# EAGLE design led_dimmer2 (EAGLE 6.5.0)
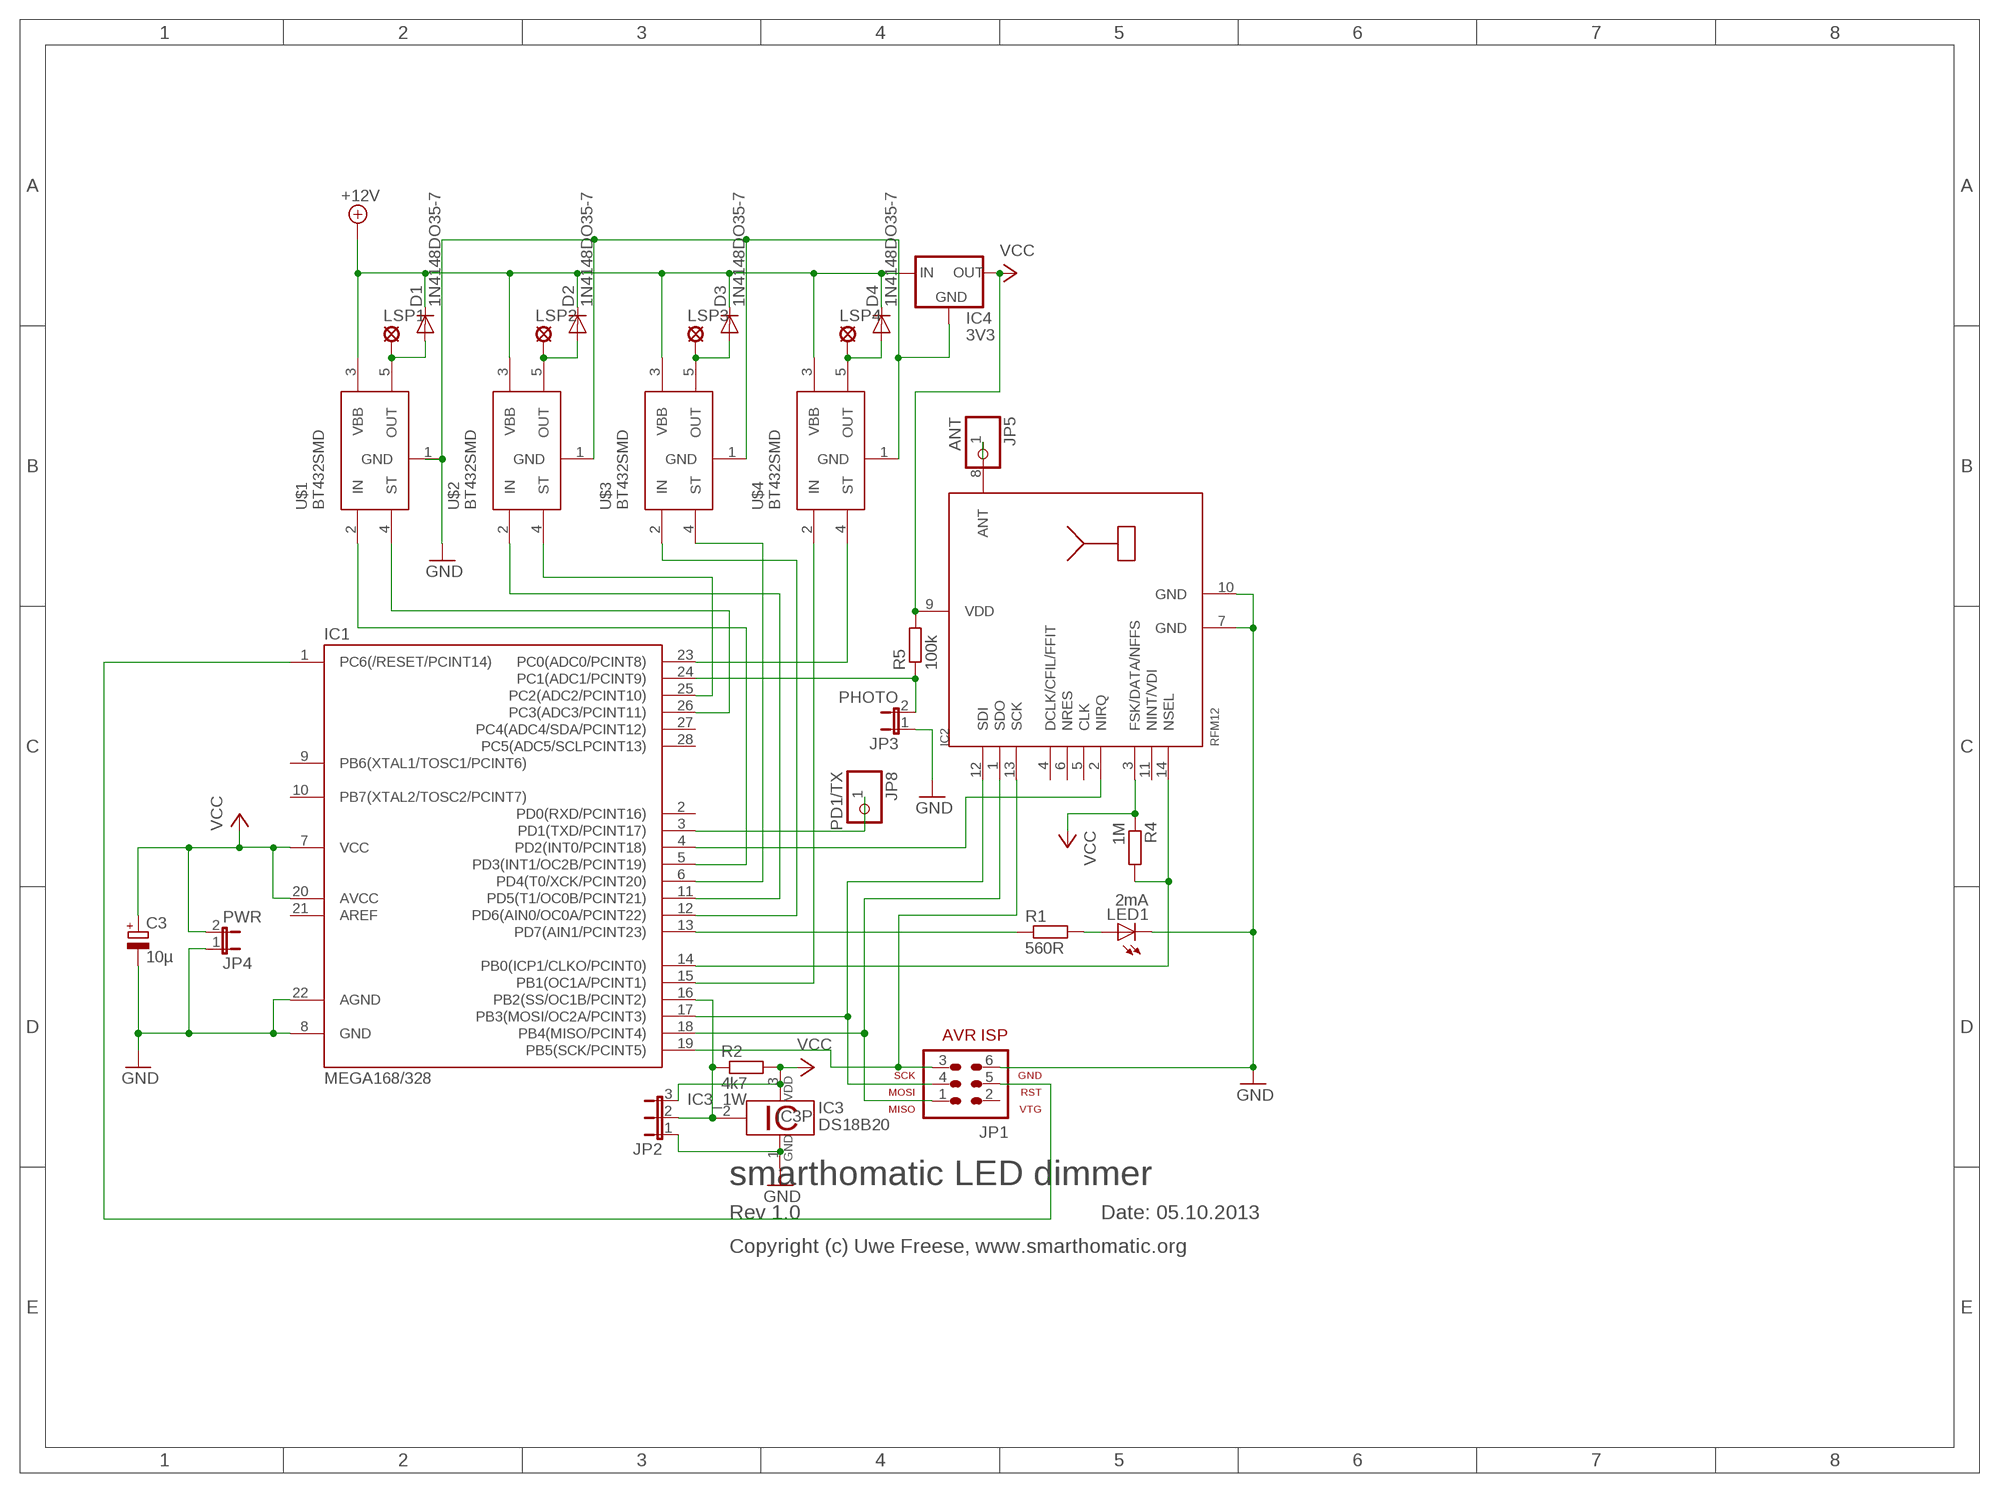
[diagram p0: schematic, sheet 1]

## Parts
C3  10µ  CPOL-EUE2.5-6  [E2,5-6]
D1  1N4148DO35-7  [DO35-7]
D2  1N4148DO35-7  [DO35-7]
D3  1N4148DO35-7  [DO35-7]
D4  1N4148DO35-7  [DO35-7]
IC1  MEGA168/328  MEGA48/88/168-PU  [DIL28-3]
IC2  RFM12  [RFM]
IC3  DS18B20  [TO92-]
IC4  3V3  78LXX  [78LXX]
JP1  AVR-ISP-6  [AVR-ISP-6]
JP2  JP2E  [JP2]
JP3  PHOTO  JP1E  [JP1]
JP4  PWR  JP1E  [JP1]
JP5  ANT  PINHD-1X1  [1X01]
JP8  PD1/TX  PINHD-1X1  [1X01]
LED1  2mA  LED3MM  [LED3MM]
LSP1  MCS10B  [MCS10B]
LSP2  MCS10B  [MCS10B]
LSP3  MCS10B  [MCS10B]
LSP4  MCS10B  [MCS10B]
R1  560R  R-EU_0207/7  [0207/7]
R2  4k7  R-EU_0207/7  [0207/7]
R4  1M  R-EU_0207/7  [0207/7]
R5  100k  R-EU_0207/7  [0207/7]
U$1  BT432SMD  [TO220-58]
U$2  BT432SMD  [TO220-58]
U$3  BT432SMD  [TO220-58]
U$4  BT432SMD  [TO220-58]

## Nets
+12V: D1.C D2.C D3.C D4.C IC4.IN U$1.3(VBB) U$2.3(VBB) U$3.3(VBB) U$4.3(VBB)
GND: C3.- IC1.8(GND) IC1.22(AGND) IC2.7(GND) IC2.10(GND) IC3.1 IC4.GND JP1.6 JP2.1 JP3.1 JP4.1 LED1.K(C) U$1.1(GND) U$2.1(GND) U$3.1(GND) U$4.1(GND)
N$1: IC1.24(PC1(ADC1/PCINT9)) JP3.2 R5.1
N$2: IC1.23(PC0(ADC0/PCINT8)) U$4.4(ST)
N$3: IC1.17(PB3(MOSI/OC2A/PCINT3)) IC2.12(SDI) JP1.4
N$4: IC1.18(PB4(MISO/PCINT4)) IC2.1(SDO) JP1.1
N$5: IC1.19(PB5(SCK/PCINT5)) IC2.13(SCK) JP1.3
N$6: IC1.13(PD7(AIN1/PCINT23)) R1.1
N$7: D1.A LSP1.MP U$1.5(OUT)
N$8: IC1.1(PC6(/RESET/PCINT14)) JP1.5
N$9: D2.A LSP2.MP U$2.5(OUT)
N$10: D3.A LSP3.MP U$3.5(OUT)
N$11: IC2.8(ANT) JP5.1
N$12: LED1.A R1.2
N$13: IC1.14(PB0(ICP1/CLKO/PCINT0)) IC2.14(NSEL) R4.2
N$14: D4.A LSP4.MP U$4.5(OUT)
N$15: IC1.4(PD2(INT0/PCINT18)) IC2.2(NIRQ)
N$16: IC1.5(PD3(INT1/OC2B/PCINT19)) U$1.2(IN)
N$17: IC1.11(PD5(T1/OC0B/PCINT21)) U$2.2(IN)
N$18: IC1.12(PD6(AIN0/OC0A/PCINT22)) U$3.2(IN)
N$19: IC1.16(PB2(SS/OC1B/PCINT2)) IC3.2 JP2.2 R2.1
N$20: IC1.3(PD1(TXD/PCINT17)) JP8.1
N$21: IC1.15(PB1(OC1A/PCINT1)) U$4.2(IN)
N$22: IC1.6(PD4(T0/XCK/PCINT20)) U$3.4(ST)
N$24: IC1.25(PC2(ADC2/PCINT10)) U$2.4(ST)
N$25: IC1.26(PC3(ADC3/PCINT11)) U$1.4(ST)
VCC: C3.+ IC1.7(VCC) IC1.20(AVCC) IC2.3(FSK/DATA/NFFS) IC2.9(VDD) IC3.3 IC4.OUT JP2.3 JP4.2 R2.2 R4.1 R5.2
Unconnected: IC1.2(PD0(RXD/PCINT16)) IC1.9(PB6(XTAL1/TOSC1/PCINT6)) IC1.10(PB7(XTAL2/TOSC2/PCINT7)) IC1.21(AREF) IC1.27(PC4(ADC4/SDA/PCINT12)) IC1.28(PC5(ADC5/SCLPCINT13)) IC2.4(DCLK/CFIL/FFIT) IC2.5(CLK) IC2.6(NRES) IC2.11(NINT/VDI) JP1.2

## Notes on the sheet
- smarthomatic LED dimmer
- Rev 1.0 | Date: 05.10.2013
- Copyright (c) Uwe Freese, www.smarthomatic.org

## Library data of the parts
C3 = rcl:CPOL-EU: POLARIZED CAPACITOR, European symbol
D1-D4 = diode:1N4148: DIODE high speed (Philips)
IC1 = avr-5-4.16:MEGA48/88/168-PU
IC2 = hopeRF:RFM12
IC3 = 1wire:DS18B20: Programmable Resolution Digital Thermometer This chip provides a onewire thermosensor with approx. 0.5°C accuracy. A programmable over/undertemperure alarm is available. The precision can be set from 9..12 bits. Notes: Vdd must be applied for accurate measurements at low temperatures, as the parasite power circuit otherwise heats the sensor. If parasite power is used, Vdd has to be connected to GND. The DS1822 is a low-cost thermometer chip, the DS18S20 is similar to the DS18B20, but with 9 Bit precision only. Author: Jan Kandziora <jjj@gmx.de>
IC4 = v-reg:78LXX: VOLTAGE REGULATOR
JP1 = avr-5-4.16:AVR-ISP-6: AVR ISP-6 Serial Programming Header
JP2 = jumper:JP2E: JUMPER
JP3 JP4 = jumper:JP1E: JUMPER
JP5 JP8 = pinhead:PINHD-1X1: PIN HEADER
LED1 = led:LED: LED OSRAM: - CHIPLED LG R971, LG N971, LY N971, LG Q971, LY Q971, LO R971, LY R971 LH N974, LH R974 LS Q976, LO Q976, LY Q976 LO Q996 - Hyper CHIPLED LW Q18S LB Q993, LB Q99A, LB R99A - SideLED LS A670, LO A670, LY A670, LG A670, LP A670 LB A673, LV A673, LT A673, LW A673 LH A674 LY A675 LS A676, LA A676, LO A676, LY A676, LW A676 LS A679, LY A679, LG A679 - Hyper Micro SIDELED® LS Y876, LA Y876, LO Y876, LY Y876 LT Y87S - SmartLED LW L88C, LW L88S LB L89C, LB L89S, LG L890 LS L89K, LO L89K, LY L89K LS L896, LA L896, LO L896, LY L896 - TOPLED LS T670, LO T670, LY T670, LG T670, LP T670 LSG T670, LSP T670, LSY T670, LOP T670, LYG T670 LG T671, LOG T671, LSG T671 LB T673, LV T673, LT T673, LW T673 LH T674 LS T676, LA T676, LO T676, LY T676, LB T676, LH T676, LSB T676, LW T676 LB T67C, LV T67C, LT T67C, LS T67K, LO T67K, LY T67K, LW E67C LS E67B, LA E67B, LO E67B, LY E67B, LB E67C, LV E67C, LT E67C LW T67C LS T679, LY T679, LG T679 LS T770, LO T770, LY T770, LG T770, LP T770 LB T773, LV T773, LT T773, LW T773 LH T774 LS E675, LA E675, LY E675, LS T675 LS T776, LA T776, LO T776, LY T776, LB T776 LHGB T686 LT T68C, LB T68C - Hyper Mini TOPLED® LB M676 - Mini TOPLED Santana® LG M470 LS M47K, LO M47K, LY M47K Source: http://www.osram.convergy.de LUXEON: - LUMILED® LXK2-PW12-R00, LXK2-PW12-S00, LXK2-PW14-U00, LXK2-PW14-V00 LXK2-PM12-R00, LXK2-PM12-S00, LXK2-PM14-U00 LXK2-PE12-Q00, LXK2-PE12-R00, LXK2-PE12-S00, LXK2-PE14-T00, LXK2-PE14-U00 LXK2-PB12-K00, LXK2-PB12-L00, LXK2-PB12-M00, LXK2-PB14-N00, LXK2-PB14-P00, LXK2-PB14-Q00 LXK2-PR12-L00, LXK2-PR12-M00, LXK2-PR14-Q00, LXK2-PR14-R00 LXK2-PD12-Q00, LXK2-PD12-R00, LXK2-PD12-S00 LXK2-PH12-R00, LXK2-PH12-S00 LXK2-PL12-P00, LXK2-PL12-Q00, LXK2-PL12-R00 Source: www.luxeon.com KINGBRIGHT: KA-3528ASYC Source: www.kingbright.com
LSP1-LSP4 = solpad:MCS10B: SOLDER PAD MC S1, distributor Buerklin, 15F505
R1 R4 R5 = rcl:R-EU_: RESISTOR, European symbol
R2 = resistor:R-EU_: RESISTOR, European symbol
U$1-U$4 = missingstuff:BT432

## Net classes
0 default: clearance 0.305 mm

## Board
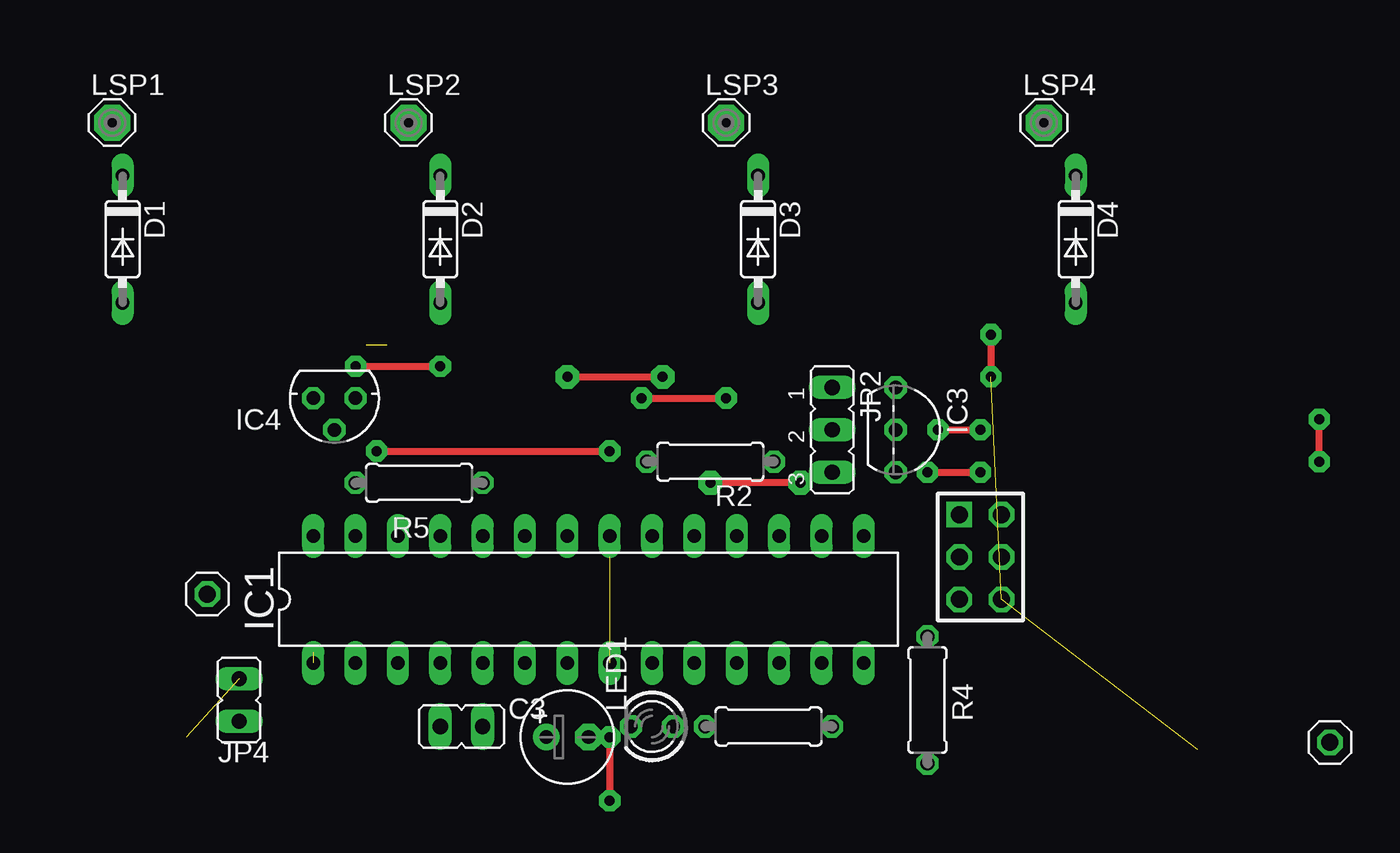
[diagram p1: board, top side]
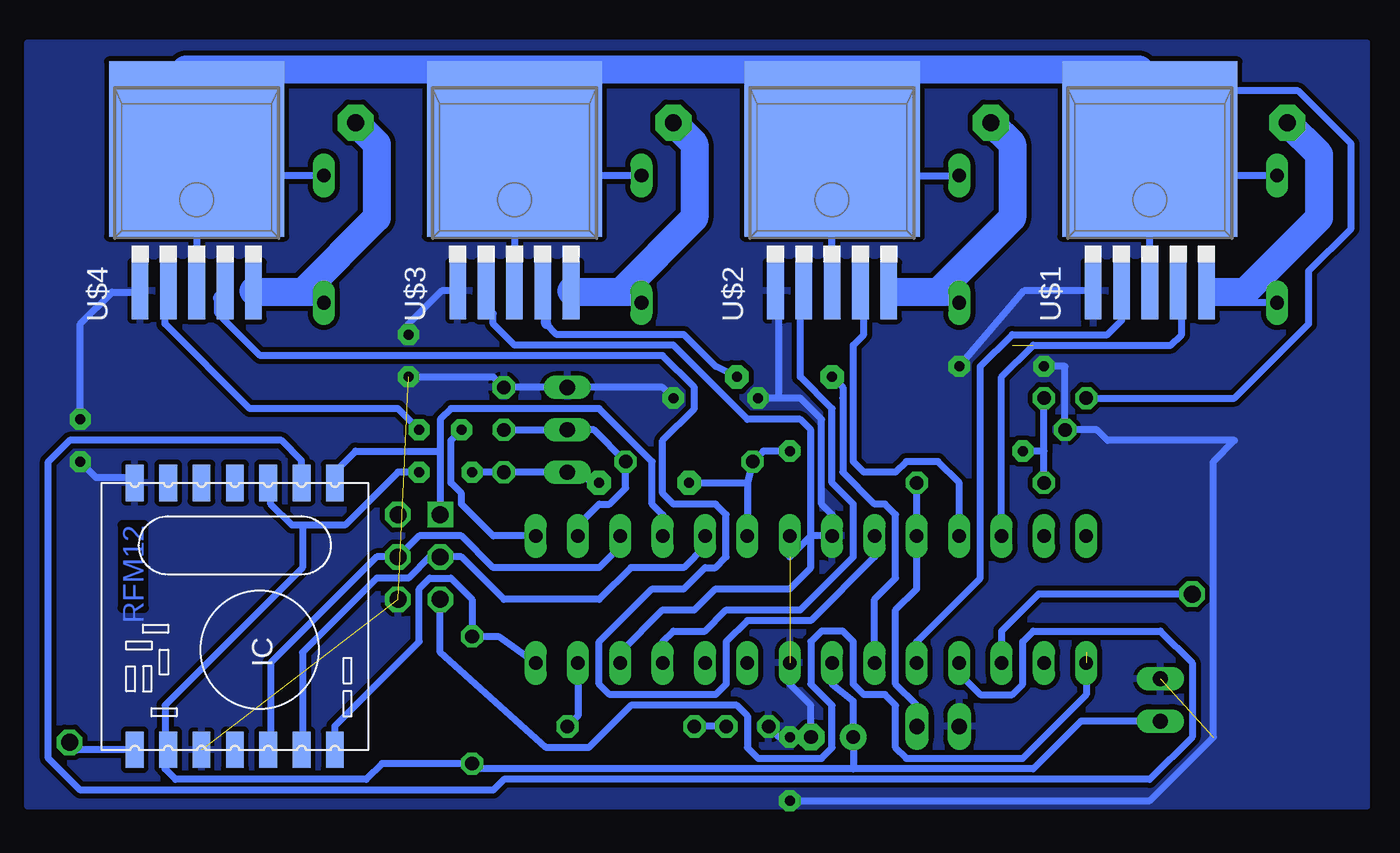
[diagram p2: board, bottom side, seen from below]

No outline drawn. Coordinates in mm, seen from the top.
Copper layers (1*16): Top 0.035mm / dielectric 1.5mm / Bottom 0.035mm
Design rules "Fusion_eagle_rule_v1.1": minimum track width 6mil, minimum drill 12mil, track to track 6mil, track to pad 6mil, pad to pad 6mil, via to via 6mil, smd to smd 0mil, copper to edge 10mil, drill to drill 10mil, minimum pad ring 10mil, minimum via ring 6mil, stop-mask expansion 2mil, vias tented up to drill 100mil, thermal gap 10mil

### Footprints (pad centres in the part's own frame; a part is rotated, then mirrored left to right if it is on the bottom)
E2,5-6 = drill 0.813 pad 1.6: + -1.27,0 | drill 0.813 pad 1.6 octagon: - 1.27,0
DO35-7 = drill 0.813 long: A 3.81,0; C -3.81,0
DIL28-3 = drill 0.813 long: 1 -16.51,-3.81; 2 -13.97,-3.81; 3 -11.43,-3.81; 4 -8.89,-3.81; 5 -6.35,-3.81; 6 -3.81,-3.81; 7 -1.27,-3.81; 8 1.27,-3.81; 9 3.81,-3.81; 10 6.35,-3.81; 11 8.89,-3.81; 12 11.43,-3.81; 13 13.97,-3.81; 14 16.51,-3.81; 15 16.51,3.81; 16 13.97,3.81; 17 11.43,3.81; 18 8.89,3.81; 19 6.35,3.81; 20 3.81,3.81; 21 1.27,3.81; 22 -1.27,3.81; 23 -3.81,3.81; 24 -6.35,3.81; 25 -8.89,3.81; 26 -11.43,3.81; 27 -13.97,3.81; 28 -16.51,3.81
RFM = smd 2.184 x 1.067: 1 0,14; 2 0,12; 3 0,10; 4 0,8; 5 0,6; 6 0,4; 7 0,2; 8 16,2; 9 16,4; 10 16,6; 11 16,8; 12 16,10; 13 16,12; 14 16,14
TO92- = drill 0.813 octagon: 1 -2.54,0; 2 0,0; 3 2.54,0
78LXX = drill 0.813 octagon: GND 0,1.905; IN 1.27,0; OUT -1.27,0
AVR-ISP-6 = drill 1.016 square: 1 -2.54,-1.27 | drill 1.016 octagon: 2 -2.54,1.27; 3 0,-1.27; 4 0,1.27; 5 2.54,-1.27; 6 2.54,1.27
JP2 = drill 0.914 long: 1 -2.54,0; 2 0,0; 3 2.54,0
JP1 = drill 0.914 long: 1 0,-1.27; 2 0,1.27
1X01 = drill 1.016 octagon: 1 0,0
LED3MM = drill 0.813 octagon: A -1.27,0; K 1.27,0
MCS10B = drill 1.016 pad 2.159 octagon: MP 0,0
0207/7 = drill 0.813 octagon: 1 -3.81,0; 2 3.81,0
TO220-58 = smd 1 x 3.4: 1 -3.4,-5; 2 -1.7,-5; 3 0,-5; 4 1.7,-5; 5 3.4,-5 | smd 10.5 x 10.5: 6 0,3.5

### Placement (x,y rotation side)
C3  32.38,4.45 0 top
D1  5.71,34.29 270 top
D2  24.77,34.29 270 top
D3  43.81,34.29 270 top
D4  62.87,34.29 270 top
IC1  33.66,12.7 0 top
IC2  76.2,19.68 270 bottom
IC3  52.07,22.86 270 top
IC4  18.41,24.77 180 top
JP1  57.15,15.24 270 top
JP2  48.26,22.86 270 top
JP3  26.04,5.08 270 top
JP4  12.7,6.67 180 top
JP5  78.11,4.13 270 top
JP8  10.79,13.02 0 top
LED1  37.47,5.08 180 top
LSP1  5.08,41.27 0 top
LSP2  22.86,41.27 0 top
LSP3  41.91,41.27 0 top
LSP4  60.96,41.27 0 top
R1  44.45,5.08 180 top
R2  40.96,20.95 180 top
R4  53.98,6.67 90 top
R5  23.5,19.68 180 top
U$1  13.34,36.2 0 bottom
U$2  32.38,36.2 0 bottom
U$3  51.44,36.2 0 bottom
U$4  70.48,36.2 0 bottom

### Tracks (layer width: path | path; a pad name or v marks a point on that pad's centre or on a via)
+12V
  Bottom 0.406: 32.38,38.1 D2.C | U$1.3 13.34,38.1 | 13.34,38.1 13.34,42.55 13.65,42.86 | 13.65,42.86 15.24,44.45 32.38,44.45 | 32.38,44.45 32.38,38.1 | U$2.3 32.38,38.1 | 32.38,44.45 51.44,44.45 | 51.44,38.73 U$3.3 | D3.C 50.8,38.1 51.44,38.73 | D4.C 66.67,38.1 | 66.67,38.1 70.48,38.1 U$4.3 | 51.44,38.73 51.44,44.45 | 51.44,44.45 66.67,44.45 66.67,38.1 | D1.C 13.34,38.1 | IC4.IN 8.26,24.77 3.81,29.21 3.81,32.38 1.27,34.92 1.27,40.01 4.45,43.18 13.34,43.18 13.65,42.86
GND  (via drill 0.6 pad 1.27)  (4 unrouted)
  Top 0.406: v36.83,24.77 v41.91,24.77 | v57.78,28.57 v57.78,26.04 | v19.68,26.67 v24.77,26.67 | v34.92,4.45 v34.92,0.64 | v77.47,20.95 v77.47,23.5
  Bottom 0.406: IC1.8 34.92,7.62 33.66,6.35 C3.- v34.92,4.45 35.56,4.45 LED1.K | IC2.7 73.89,20 76.52,20 v77.47,20.95 | 35.56,24.77 34.29,24.77 33.02,23.5 33.02,18.41 32.38,17.78 IC1.22 33.66,16.51 34.92,15.24 | 35.56,24.77 35.56,30.97 U$2.1 | 35.56,24.77 v36.83,24.77 | v41.91,24.77 42.55,25.4 JP2.1 IC3.1 52.7,26.04 v57.78,26.04 | U$3.1 55.8,31.2 57.78,29.21 v57.78,28.57 | U$1.1 20.88,31.2 v24.77,26.67 | v19.68,26.67 18.41,26.67 IC4.GND 16.51,22.86 15.88,22.23 8.26,22.23 9.53,20.95 9.53,4.45 13.34,0.64 v34.92,0.64 | v77.47,23.5 77.47,29.21 75.56,31.11 73.97,31.11 U$4.1
  pour Bottom: 0.32,46.04 80.64,46.04 80.64,0.32 0.32,0.32
N$1
  Bottom 0.406: R5.1 IC1.24 27.3,13.34 28.57,12.06 28.57,7.62 27.3,6.35 JP3.2
N$2
  Bottom 0.406: IC1.23 29.84,15.24 33.66,11.43 37.47,11.43 38.73,10.16 38.73,7.62 39.37,6.99 45.72,6.99 46.35,7.62 46.35,10.16 43.18,13.34 41.27,13.34 40.01,14.61 39.37,14.61 38.73,15.24 38.73,17.78 39.37,18.41 41.91,18.41 42.55,19.05 42.55,22.23 40.64,24.13 40.64,25.4 42.55,27.3 66.67,27.3 69.22,29.84 69.22,30.77
  Bottom 0.61: 69.22,30.77 U$4.4
N$3
  Bottom 0.406: IC2.12 66.04,3.85 66.04,8.89 59.69,15.24 JP1.4 57.15,16.51 54.61,16.51 52.7,14.61 46.35,14.61 45.09,15.88 IC1.17
N$4
  Bottom 0.406: 55.88,21.59 55.88,23.5 55.24,24.13 46.35,24.13 43.18,20.95 43.18,18.41 42.55,17.78 IC1.18 | 55.88,21.59 JP1.1 | IC2.1 62.23,20.32 60.96,21.59 55.88,21.59
N$5
  Bottom 0.406: IC1.19 40.01,15.88 41.27,14.61 44.45,14.61 46.35,12.7 52.07,12.7 54.61,15.24 JP1.3 56.52,15.24 57.78,13.97 59.69,13.97 64.14,9.53 64.14,3.75 IC2.13
N$6
  Bottom 0.406: IC1.13 47.62,5.71 R1.1
N$7
  Bottom 0.406: 7.54,31.2 7.62,31.11 9.53,31.11 9.61,31.2 U$1.5 9.22,30.48 D1.A
  Bottom 1.676: 7.54,31.2 3.17,35.56 3.17,39.37 LSP1.MP
N$8  (1 unrouted)
  Bottom 0.406: IC1.1 17.14,6.99 20.95,3.17 27.94,3.17 28.57,3.81 28.57,6.35 29.21,6.99 30.48,6.99 31.11,7.62 31.11,10.16 31.75,10.79 33.02,10.79 33.66,10.16 33.66,7.62 32.38,6.35 32.38,3.81 33.02,3.17 36.83,3.17 37.47,3.81 37.47,5.71 38.1,6.35 44.45,6.35 46.99,3.81 49.53,3.81 55.88,9.53 JP1.5
N$9
  Bottom 0.406: D2.A 28.98,30.48 U$2.5 28.98,31.11 28.57,31.11
  Bottom 1.676: LSP2.MP 21.59,40.01 21.59,35.56 26.04,31.11 28.57,31.11
N$10
  Bottom 0.406: D3.A 45.09,30.48 45.72,31.11
  Bottom 1.676: LSP3.MP 40.64,40.01 40.64,35.56 45.09,31.11 45.72,31.11 47.95,31.11 U$3.5
N$11
  Bottom 0.406: IC2.8 77.66,3.69 JP5.1
N$12
  Bottom 0.406: LED1.A R1.2
N$13
  Bottom 0.406: IC1.14 52.39,10.48 R4.2 53.98,12.7 55.24,13.97 56.52,13.97 57.15,13.34 57.15,10.16 62.2,5.11 IC2.14
N$14
  Bottom 0.406: D4.A 64.14,30.48 64.77,31.11
  Bottom 1.676: LSP4.MP 59.69,40.01 59.69,35.56 64.14,31.11 64.77,31.11 67,31.11 U$4.5
N$15
  Bottom 0.406: IC1.4 24.77,8.26 23.5,6.99 21.59,6.99 20.95,7.62 20.95,10.16 20.32,10.79 12.7,10.79 10.79,8.89 10.79,4.45 13.34,1.91 52.07,1.91 52.7,1.27 77.47,1.27 79.38,3.17 79.38,20.95 78.11,22.23 65.41,22.23 64.2,21.02 IC2.2
N$16
  Bottom 0.406: IC1.5 27.3,10.16 23.5,13.97 23.5,26.67 21.59,28.57 15.88,28.57 15.04,29.41 U$1.2
N$17
  Bottom 0.406: IC1.11 42.55,10.16 41.91,10.79 40.01,10.79 38.73,12.06 34.29,12.06 31.11,15.24 31.11,18.41 32.38,19.68 32.38,24.13 34.29,26.04 34.29,30.99 U$2.2
N$18
  Bottom 0.406: IC1.12 45.09,9.53 42.55,12.06 40.64,12.06 39.37,13.34 34.92,13.34 33.66,14.61 33.66,22.86 34.29,23.5 37.47,23.5 41.91,27.94 51.44,27.94 52.7,29.21 52.7,29.84 53.34,30.48 53.34,30.99
  Bottom 0.61: 53.34,30.99 U$3.2
N$19
  Bottom 0.406: IC3.2 JP2.2 46.67,22.86 R2.1 44.77,19.37 45.72,18.41 46.35,18.41 47.62,17.14 IC1.16
N$20
  Bottom 0.406: JP8.1 20,13.02 22.23,10.79 IC1.3
N$21  (via drill 0.6 pad 1.27)
  Top 0.406: v54.61,22.86 v57.15,22.86
  Bottom 0.406: IC1.15 52.7,16.51 54.61,18.41 54.61,19.05 55.24,19.68 55.24,22.23 v54.61,22.86 | v57.15,22.86 58.42,24.13 67.31,24.13 72.39,29.21 72.39,30.99 U$4.2
N$22  (via drill 0.6 pad 1.42)
  Top 0.406: v32.38,26.04 v38.1,26.04
  Bottom 0.406: IC1.6 29.84,12.7 28.57,13.97 28.57,17.78 29.21,18.41 29.84,18.41 31.75,20.32 31.75,24.77 31.75,25.4 v32.38,26.04 | v38.1,26.04 39.37,26.67 41.27,28.57 48.9,28.57 49.53,29.21
  Bottom 0.61: 49.53,29.21 49.53,30.99 U$3.4
N$23
  Bottom 1.676: 7.62,31.11 9.53,31.11
N$24
  Bottom 0.406: 30.48,30.99 30.48,28.57 31.11,27.94 31.11,20.95 30.48,20.32 28.57,20.32 27.94,20.95 26.04,20.95 24.77,19.68 IC1.25
  Bottom 0.61: 30.48,30.99 U$2.4
N$25  (1 unrouted)
  Bottom 0.406: 11.43,30.99 11.43,28.57 12.06,27.94 20.32,27.94 22.23,26.04 IC1.26
  Bottom 0.61: 11.43,30.99 U$1.4
N$26
  Bottom 1.676: 13.34,43.81 13.97,44.45 71.12,44.45
N$27
  Bottom 0.406: 13.34,31.11 13.34,39.37
VCC  (via drill 0.6 pad 1.27, 0.6 pad 1.42)
  Top 0.406: v46.35,19.68 v40.96,19.68 | v53.98,20.32 v57.15,20.32 | v20.95,21.59 v34.92,21.59
  Bottom 0.406: 37.47,19.68 R2.2 36.51,21.59 v34.92,21.59 | v40.96,19.68 37.47,19.68 | 37.47,19.68 37.47,17.14 37.15,16.83 IC1.20 | v46.35,19.68 JP2.3 IC3.3 v53.98,20.32 | IC1.7 32.38,7.62 31.11,6.6 C3.+ 31.11,2.54 | 31.11,2.54 53.66,2.54 R4.1 59.37,2.86 60.33,1.91 71.75,1.91 72.39,2.54 72.39,3.5 IC2.9 72.39,3.88 72.39,6.35 64.14,14.61 64.14,17.14 | R5.2 19.68,21.59 | 19.68,21.59 IC4.OUT | JP4.2 17.46,5.4 20.32,2.54 31.11,2.54 | v57.15,20.32 58.42,20.32 61.59,17.14 64.14,17.14 | 64.14,17.14 64.77,17.14 66.04,18.41 66.04,19.52 IC2.3 | 19.68,21.59 v20.95,21.59